# EAGLE design J3_output_haltTrace (EAGLE 7.5.0)
Redwave S310-J6 Output to 10 Pin MiniFit Valve Driver Board
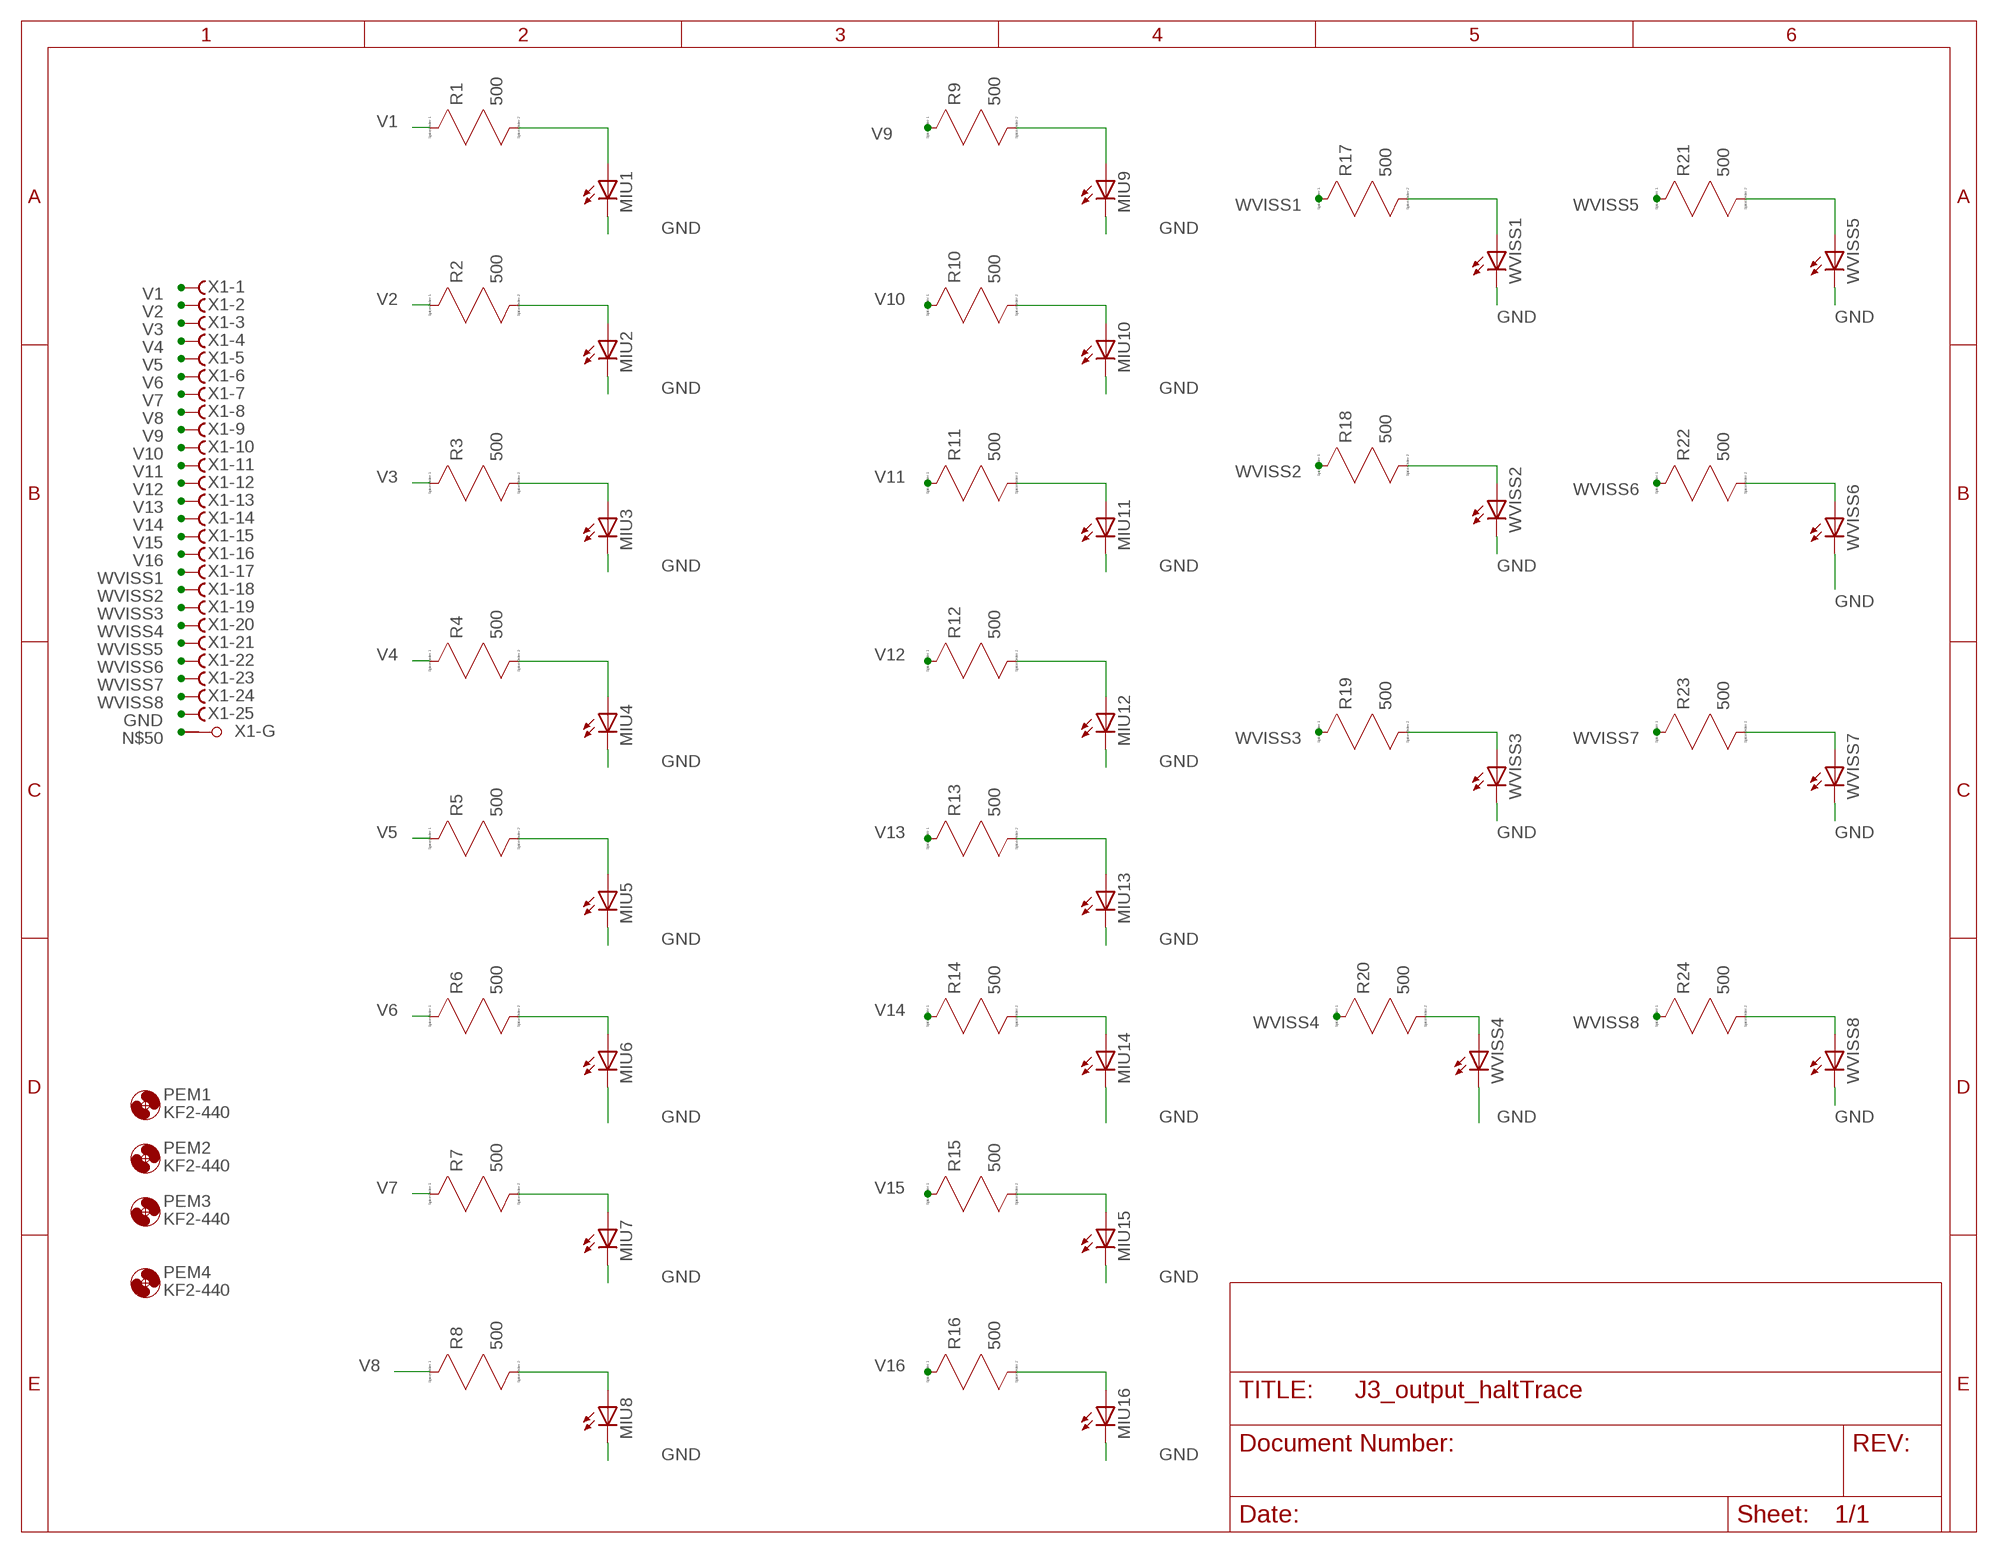
[diagram p0: schematic, sheet 1]

## Parts
MIU1  LED5MM  [LED5MM]
MIU2  LED5MM  [LED5MM]
MIU3  LED5MM  [LED5MM]
MIU4  LED5MM  [LED5MM]
MIU5  LED5MM  [LED5MM]
MIU6  LED5MM  [LED5MM]
MIU7  LED5MM  [LED5MM]
MIU8  LED5MM  [LED5MM]
MIU9  LED5MM  [LED5MM]
MIU10  LED5MM  [LED5MM]
MIU11  LED5MM  [LED5MM]
MIU12  LED5MM  [LED5MM]
MIU13  LED5MM  [LED5MM]
MIU14  LED5MM  [LED5MM]
MIU15  LED5MM  [LED5MM]
MIU16  LED5MM  [LED5MM]
PEM1  KF2-440  [KF2-440]
PEM2  KF2-440  [KF2-440]
PEM3  KF2-440  [KF2-440]
PEM4  KF2-440  [KF2-440]
R1  500  RES  [R0805]
R2  500  RES  [R0805]
R3  500  RES  [R0805]
R4  500  RES  [R0805]
R5  500  RES  [R0805]
R6  500  RES  [R0805]
R7  500  RES  [R0805]
R8  500  RES  [R0805]
R9  500  RES  [R0805]
R10  500  RES  [R0805]
R11  500  RES  [R0805]
R12  500  RES  [R0805]
R13  500  RES  [R0805]
R14  500  RES  [R0805]
R15  500  RES  [R0805]
R16  500  RES  [R0805]
R17  500  RES  [R0805]
R18  500  RES  [R0805]
R19  500  RES  [R0805]
R20  500  RES  [R0805]
R21  500  RES  [R0805]
R22  500  RES  [R0805]
R23  500  RES  [R0805]
R24  500  RES  [R0805]
WVISS1  LED5MM  [LED5MM]
WVISS2  LED5MM  [LED5MM]
WVISS3  LED5MM  [LED5MM]
WVISS4  LED5MM  [LED5MM]
WVISS5  LED5MM  [LED5MM]
WVISS6  LED5MM  [LED5MM]
WVISS7  LED5MM  [LED5MM]
WVISS8  LED5MM  [LED5MM]
X1  F25HPS  [F25HP]

## Nets
GND: MIU1.K(C) MIU2.K(C) MIU3.K(C) MIU4.K(C) MIU5.K(C) MIU6.K(C) MIU7.K(C) MIU8.K(C) MIU9.K(C) MIU10.K(C) MIU11.K(C) MIU12.K(C) MIU13.K(C) MIU14.K(C) MIU15.K(C) MIU16.K(C) WVISS1.K(C) WVISS2.K(C) WVISS3.K(C) WVISS4.K(C) WVISS5.K(C) WVISS6.K(C) WVISS7.K(C) WVISS8.K(C) X1.25(-25:F)
N$1: MIU1.A R1.2(B)
N$2: MIU2.A R2.2(B)
N$3: MIU3.A R3.2(B)
N$4: MIU4.A R4.2(B)
N$5: MIU5.A R5.2(B)
N$6: MIU6.A R6.2(B)
N$7: MIU7.A R7.2(B)
N$8: MIU8.A R8.2(B)
N$9: MIU9.A R9.2(B)
N$10: MIU10.A R10.2(B)
N$11: MIU11.A R11.2(B)
N$12: MIU12.A R12.2(B)
N$13: MIU13.A R13.2(B)
N$14: MIU14.A R14.2(B)
N$15: MIU15.A R15.2(B)
N$16: MIU16.A R16.2(B)
N$17: R17.2(B) WVISS1.A
N$18: R18.2(B) WVISS2.A
N$19: R19.2(B) WVISS3.A
N$20: R20.2(B) WVISS4.A
N$21: R21.2(B) WVISS5.A
N$22: R22.2(B) WVISS6.A
N$23: R23.2(B) WVISS7.A
N$24: R24.2(B) WVISS8.A
N$50: X1.G1(-G:G1)
V1: R1.1(A) X1.1(-1:F)
V2: R2.1(A) X1.2(-2:F)
V3: R3.1(A) X1.3(-3:F)
V4: R4.1(A) X1.4(-4:F)
V5: R5.1(A) X1.5(-5:F)
V6: R6.1(A) X1.6(-6:F)
V7: R7.1(A) X1.7(-7:F)
V8: R8.1(A) X1.8(-8:F)
V9: R9.1(A) X1.9(-9:F)
V10: R10.1(A) X1.10(-10:F)
V11: R11.1(A) X1.11(-11:F)
V12: R12.1(A) X1.12(-12:F)
V13: R13.1(A) X1.13(-13:F)
V14: R14.1(A) X1.14(-14:F)
V15: R15.1(A) X1.15(-15:F)
V16: R16.1(A) X1.16(-16:F)
WVISS1: R17.1(A) X1.17(-17:F)
WVISS2: R18.1(A) X1.18(-18:F)
WVISS3: R19.1(A) X1.19(-19:F)
WVISS4: R20.1(A) X1.20(-20:F)
WVISS5: R21.1(A) X1.21(-21:F)
WVISS6: R22.1(A) X1.22(-22:F)
WVISS7: R23.1(A) X1.23(-23:F)
WVISS8: R24.1(A) X1.24(-24:F)
Unconnected: X1.G2(-G:G2)

## Library data of the parts
MIU1-MIU16 WVISS1-WVISS8 = led:LED: LED OSRAM: - CHIPLED LG R971, LG N971, LY N971, LG Q971, LY Q971, LO R971, LY R971 LH N974, LH R974 LS Q976, LO Q976, LY Q976 LO Q996 - Hyper CHIPLED LW Q18S LB Q993, LB Q99A, LB R99A - SideLED LS A670, LO A670, LY A670, LG A670, LP A670 LB A673, LV A673, LT A673, LW A673 LH A674 LY A675 LS A676, LA A676, LO A676, LY A676, LW A676 LS A679, LY A679, LG A679 - Hyper Micro SIDELED® LS Y876, LA Y876, LO Y876, LY Y876 LT Y87S - SmartLED LW L88C, LW L88S LB L89C, LB L89S, LG L890 LS L89K, LO L89K, LY L89K LS L896, LA L896, LO L896, LY L896 - TOPLED LS T670, LO T670, LY T670, LG T670, LP T670 LSG T670, LSP T670, LSY T670, LOP T670, LYG T670 LG T671, LOG T671, LSG T671 LB T673, LV T673, LT T673, LW T673 LH T674 LS T676, LA T676, LO T676, LY T676, LB T676, LH T676, LSB T676, LW T676 LB T67C, LV T67C, LT T67C, LS T67K, LO T67K, LY T67K, LW E67C LS E67B, LA E67B, LO E67B, LY E67B, LB E67C, LV E67C, LT E67C LW T67C LS T679, LY T679, LG T679 LS T770, LO T770, LY T770, LG T770, LP T770 LB T773, LV T773, LT T773, LW T773 LH T774 LS E675, LA E675, LY E675, LS T675 LS T776, LA T776, LO T776, LY T776, LB T776 LHGB T686 LT T68C, LB T68C - Hyper Mini TOPLED® LB M676 - Mini TOPLED Santana® LG M470 LS M47K, LO M47K, LY M47K Source: http://www.osram.convergy.de LUXEON: - LUMILED® LXK2-PW12-R00, LXK2-PW12-S00, LXK2-PW14-U00, LXK2-PW14-V00 LXK2-PM12-R00, LXK2-PM12-S00, LXK2-PM14-U00 LXK2-PE12-Q00, LXK2-PE12-R00, LXK2-PE12-S00, LXK2-PE14-T00, LXK2-PE14-U00 LXK2-PB12-K00, LXK2-PB12-L00, LXK2-PB12-M00, LXK2-PB14-N00, LXK2-PB14-P00, LXK2-PB14-Q00 LXK2-PR12-L00, LXK2-PR12-M00, LXK2-PR14-Q00, LXK2-PR14-R00 LXK2-PD12-Q00, LXK2-PD12-R00, LXK2-PD12-S00 LXK2-PH12-R00, LXK2-PH12-S00 LXK2-PL12-P00, LXK2-PL12-Q00, LXK2-PL12-R00 Source: www.luxeon.com KINGBRIGHT: KA-3528ASYC Source: www.kingbright.com; OC_NEWARK: unknown
PEM1-PEM4 = penn-engineering:KF2-: TYPE KF2 AND KFS2 BROACHING NUTS
R1-R24 = sym:RES: A resistor; MF: BC COMPONENTS; MPN: SFR2500001401FR500; OC_NEWARK: 94C4790
X1 = con-subd:F25HPS: SUB-D; OC_FARNELL: unknown; OC_NEWARK: unknown

## Board
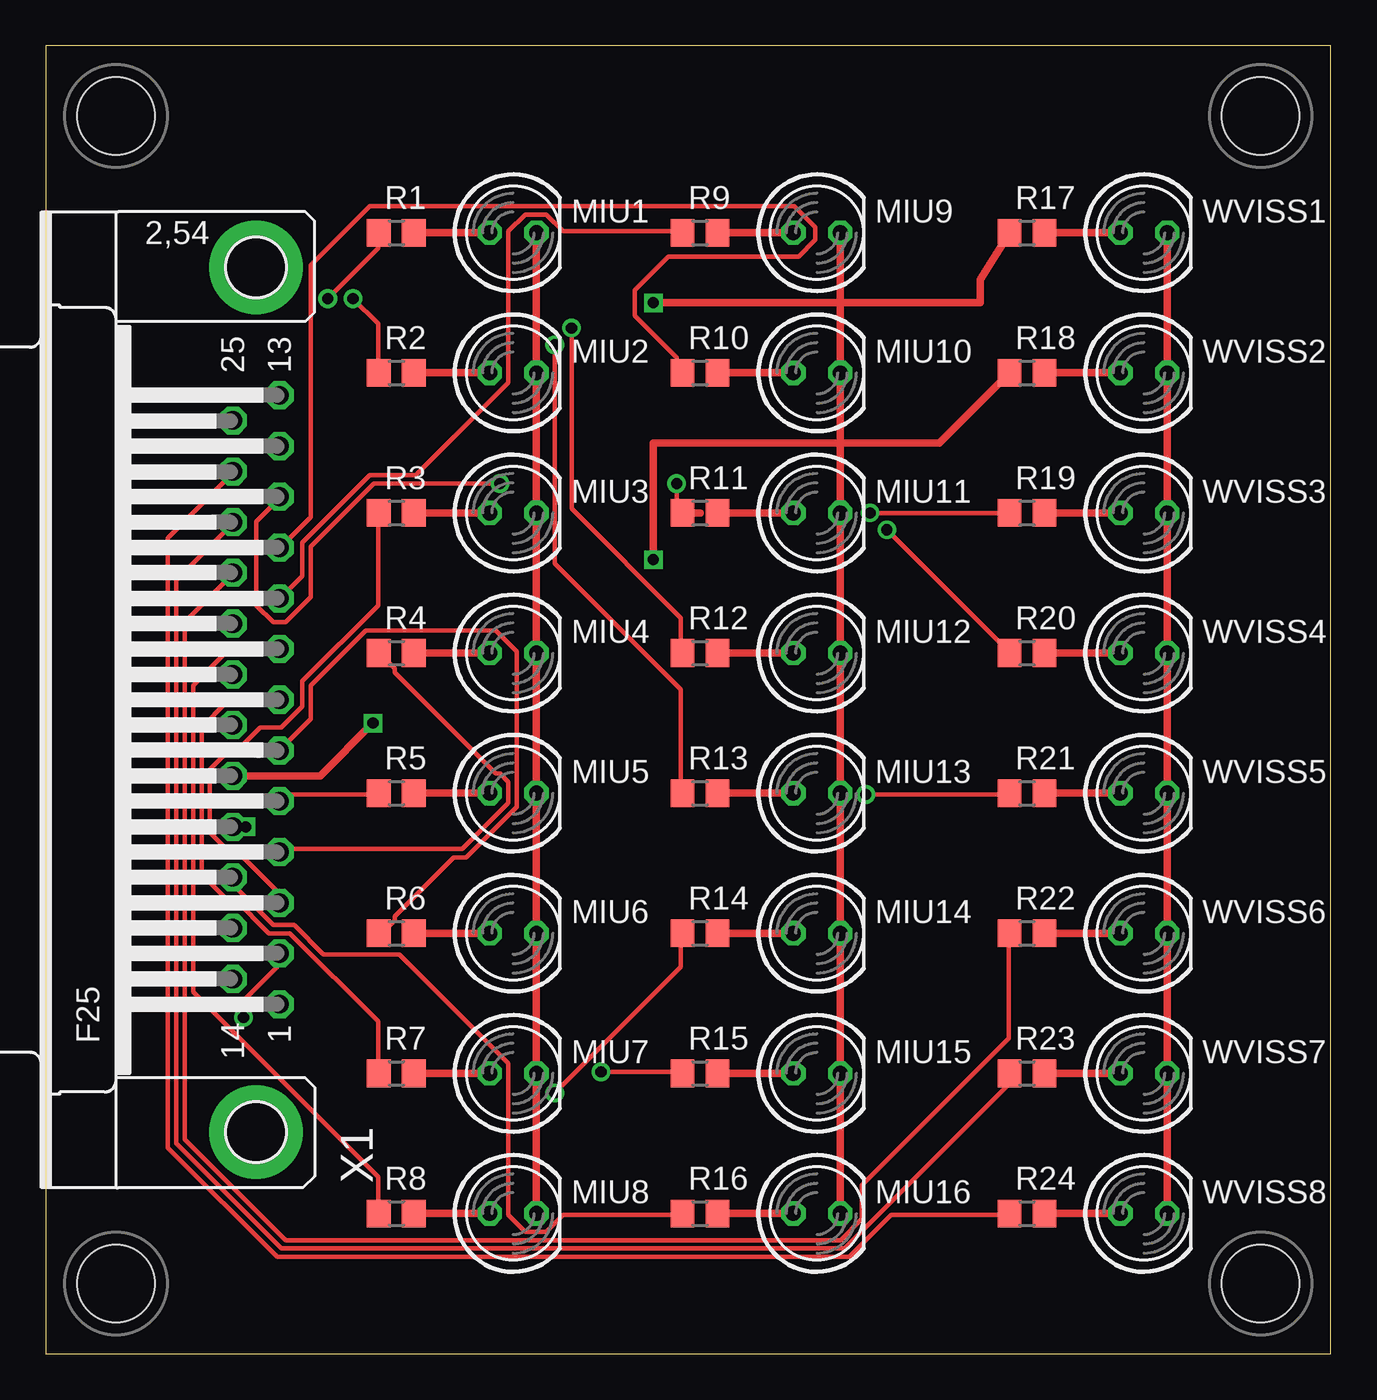
[diagram p1: board, top side]
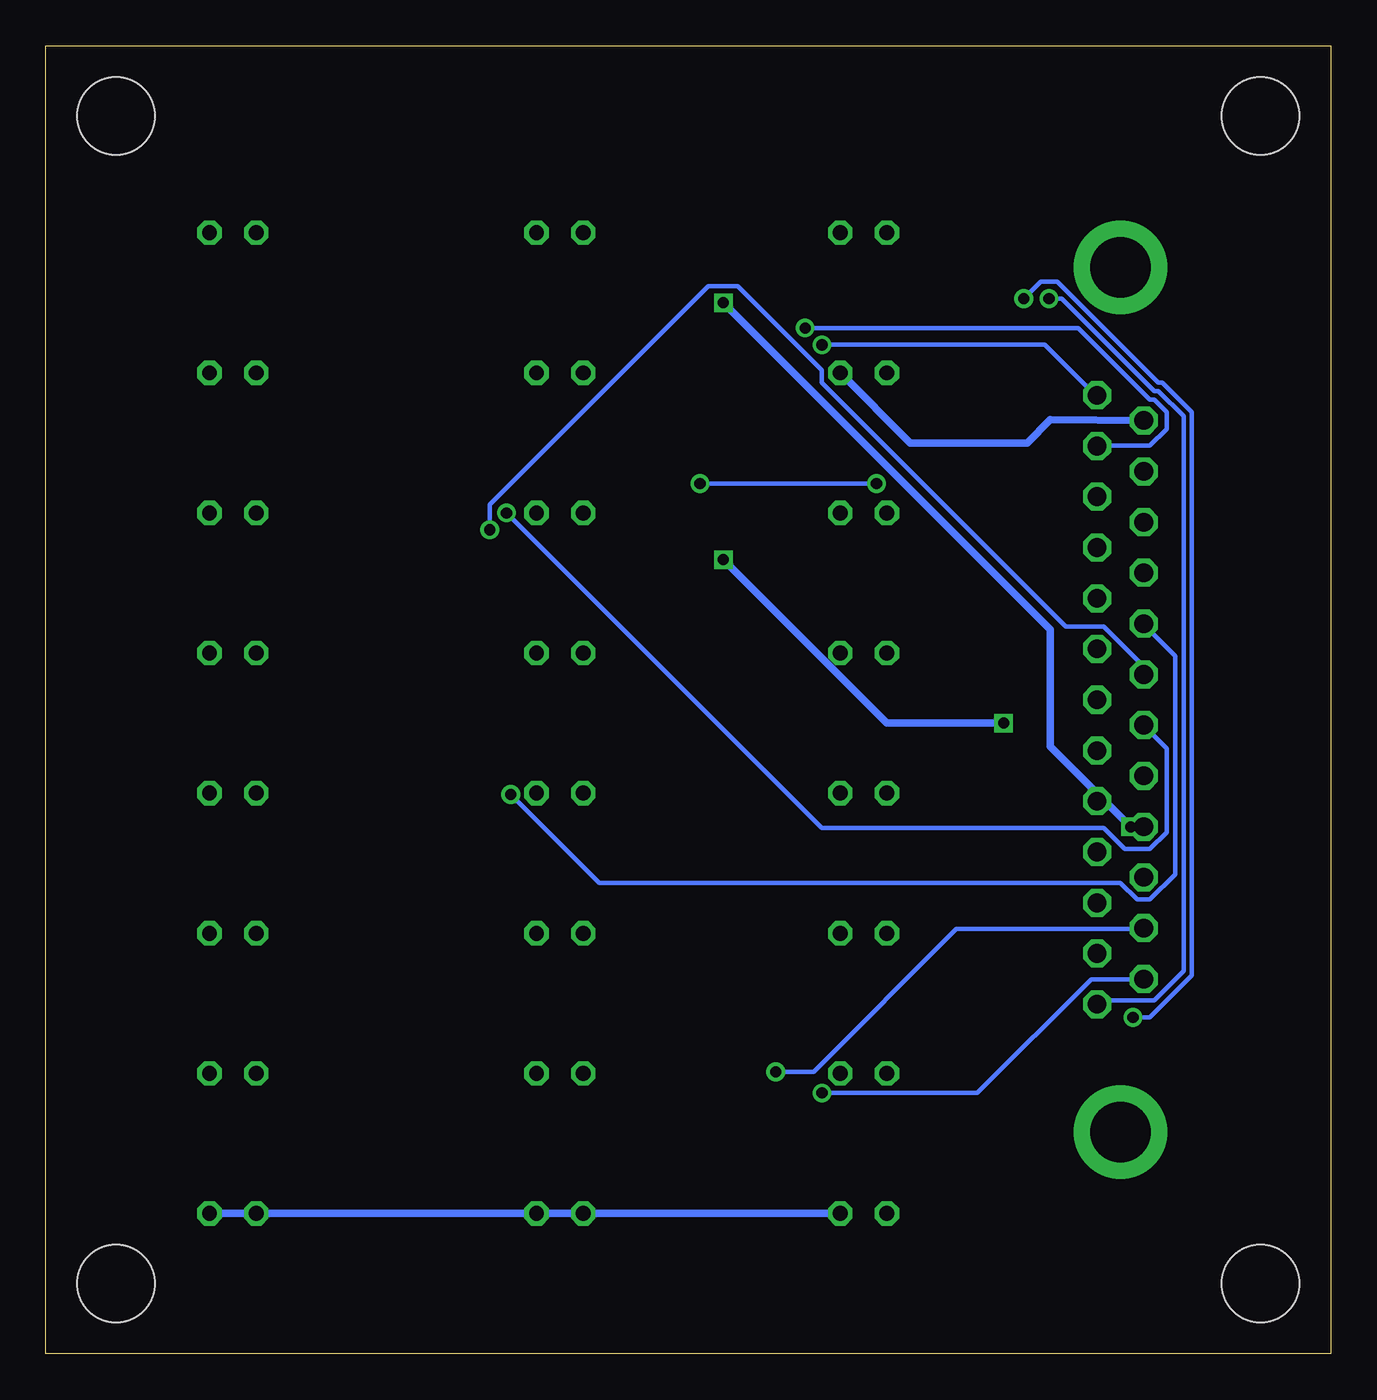
[diagram p2: board, bottom side, seen from below]

Size 69.85 x 71.12 mm. Coordinates in mm from the lower left corner, seen from the top.
Outline: 0,0 69.85,0 69.85,71.12 0,71.12 0,0
Copper layers (1*16): Top 0.035mm / dielectric 1.5mm / Bottom 0.035mm
Design rules "default": minimum track width 10mil, minimum drill 24mil, track to track 8mil, track to pad 8mil, pad to pad 8mil, via to via 8mil, smd to smd 8mil, copper to edge 40mil, drill to drill 8mil, minimum pad ring 10mil, minimum via ring 8mil, stop-mask expansion 4mil, vias tented up to drill 0mil, thermal gap 10mil

### Footprints (pad centres in the part's own frame; a part is rotated, then mirrored left to right if it is on the bottom)
LED5MM = drill 0.813 octagon: A -1.27,0; K 1.27,0
KF2-440 = hole 4.216: 0,0
R0805 = smd 1.3 x 1.5: 1 -0.95,0; 2 0.95,0
F25HP = drill 1.016 octagon: 1 -16.561,-1.27; 2 -13.792,-1.27; 3 -11.049,-1.27; 4 -8.28,-1.27; 5 -5.512,-1.27; 6 -2.769,-1.27; 7 0,-1.27; 8 2.769,-1.27; 9 5.512,-1.27; 10 8.28,-1.27; 11 11.049,-1.27; 12 13.792,-1.27; 13 16.561,-1.27; 14 -15.189,1.27; 15 -12.421,1.27; 16 -9.652,1.27; 17 -6.909,1.27; 18 -4.14,1.27; 19 -1.372,1.27; 20 1.372,1.27; 21 4.14,1.27; 22 6.909,1.27; 23 9.652,1.27; 24 12.421,1.27; 25 15.189,1.27 | drill 3.302 pad 5.08: G1 -23.52,0; G2 23.52,0

### Placement (x,y rotation side)
MIU1  25.4,60.96 0 top
MIU2  25.4,53.34 0 top
MIU3  25.4,45.72 0 top
MIU4  25.4,38.1 0 top
MIU5  25.4,30.48 0 top
MIU6  25.4,22.86 0 top
MIU7  25.4,15.24 0 top
MIU8  25.4,7.62 0 top
MIU9  41.91,60.96 0 top
MIU10  41.91,53.34 0 top
MIU11  41.91,45.72 0 top
MIU12  41.91,38.1 0 top
MIU13  41.91,30.48 0 top
MIU14  41.91,22.86 0 top
MIU15  41.91,15.24 0 top
MIU16  41.91,7.62 0 top
PEM1  3.81,3.81 0 top
PEM2  3.81,67.31 0 top
PEM3  66.04,3.81 0 top
PEM4  66.04,67.31 0 top
R1  19.05,60.96 0 top
R2  19.05,53.34 0 top
R3  19.05,45.72 0 top
R4  19.05,38.1 0 top
R5  19.05,30.48 0 top
R6  19.05,22.86 0 top
R7  19.05,15.24 0 top
R8  19.05,7.62 0 top
R9  35.56,60.96 0 top
R10  35.56,53.34 0 top
R11  35.56,45.72 0 top
R12  35.56,38.1 0 top
R13  35.56,30.48 0 top
R14  35.56,22.86 0 top
R15  35.56,15.24 0 top
R16  35.56,7.62 0 top
R17  53.34,60.96 0 top
R18  53.34,53.34 0 top
R19  53.34,45.72 0 top
R20  53.34,38.1 0 top
R21  53.34,30.48 0 top
R22  53.34,22.86 0 top
R23  53.34,15.24 0 top
R24  53.34,7.62 0 top
WVISS1  59.69,60.96 0 top
WVISS2  59.69,53.34 0 top
WVISS3  59.69,45.72 0 top
WVISS4  59.69,38.1 0 top
WVISS5  59.69,30.48 0 top
WVISS6  59.69,22.86 0 top
WVISS7  59.69,15.24 0 top
WVISS8  59.69,7.62 0 top
X1  11.43,35.56 90 top

### Tracks (layer width: path | path; a pad name or v marks a point on that pad's centre or on a via)
GND
  Top 0.406: MIU1.K MIU2.K MIU3.K MIU4.K MIU5.K MIU6.K MIU7.K MIU8.K | MIU9.K MIU10.K MIU11.K MIU12.K MIU13.K MIU14.K MIU15.K MIU16.K | WVISS1.K WVISS2.K WVISS3.K WVISS4.K WVISS5.K WVISS6.K WVISS7.K WVISS8.K
  Bottom 0.406: X1.25 15.24,50.8 16.51,49.53 22.86,49.53 MIU2.K | MIU8.K MIU16.K WVISS8.K
N$1
  Top 0.406: R1.2 MIU1.A
N$2
  Top 0.406: R2.2 MIU2.A
N$3
  Top 0.406: R3.2 MIU3.A
N$4
  Top 0.406: MIU4.A R4.2
N$5
  Top 0.406: R5.2 MIU5.A
N$6
  Top 0.406: R6.2 MIU6.A
N$7
  Top 0.406: R7.2 MIU7.A
N$8
  Top 0.406: R8.2 MIU8.A
N$9
  Top 0.406: R9.2 MIU9.A
N$10
  Top 0.406: R10.2 MIU10.A
N$11
  Top 0.406: R11.2 MIU11.A
N$12
  Top 0.406: R12.2 MIU12.A
N$13
  Top 0.406: R13.2 MIU13.A
N$14
  Top 0.406: R14.2 MIU14.A
N$15
  Top 0.406: R15.2 MIU15.A
N$16
  Top 0.406: R16.2 MIU16.A
N$17
  Top 0.406: R17.2 WVISS1.A
N$18
  Top 0.406: R18.2 WVISS2.A
N$19
  Top 0.406: R19.2 WVISS3.A
N$20
  Top 0.406: R20.2 WVISS4.A
N$21
  Top 0.406: R21.2 WVISS5.A
N$22
  Top 0.406: R22.2 WVISS6.A
N$23
  Top 0.406: R23.2 WVISS7.A
N$24
  Top 0.406: R24.2 WVISS8.A
V1  (via drill 0.61)
  Top 0.254: v15.32,57.38 18.06,60.12 18.06,60.81 R1.1
  Bottom 0.254: v15.32,57.38 14.63,57.38 9.6,52.35 9.37,52.35 8,50.98 8,20.8 9.6,19.2 12.57,19.2 X1.1
V2  (via drill 0.61)
  Top 0.254: v16.69,57.38 18.06,56.01 18.06,53.49 R2.1 | v10.74,18.29 10.74,19.2 12.57,21.03 12.57,21.72 X1.2
  Bottom 0.254: v16.69,57.38 15.77,58.29 14.86,58.29 9.37,52.81 9.14,52.81 7.54,51.21 7.54,20.57 9.83,18.29 v10.74,18.29
V3
  Top 0.254: R3.1 18.06,45.72 18.06,40.69 13.95,36.58 13.95,35.2 12.8,34.06 11.66,34.06 10.29,32.69 9.83,32.69 8.91,31.77 8.91,28.35 10.06,27.2 10.52,27.2 12.57,25.15 12.57,24.69 X1.3
V4
  Top 0.254: R4.1 18.29,37.95 18.97,37.26 18.97,37.03 24.46,31.55 24.69,31.55 25.15,31.09 25.15,29.95 22.63,27.43 12.8,27.43 X1.4
V5
  Top 0.254: R5.1 18.06,30.4 13.03,30.4 12.8,30.18 X1.5
V6
  Top 0.254: R6.1 18.29,22.86 18.97,23.55 18.97,23.77 22.17,26.98 22.86,26.98 25.6,29.72 25.6,38.18 24.46,39.32 17.37,39.32 14.4,36.35 14.4,34.52 12.8,32.92 X1.6
V7
  Top 0.254: R7.1 18.06,15.32 18.06,18.06 13.26,22.86 12.12,22.86 10.29,24.69 9.83,24.69 8.46,26.06 8.46,34.06 9.83,35.43 12.57,35.43 X1.7
V8
  Top 0.254: R8.1 18.06,7.77 18.06,9.6 8,19.66 8,36.35 9.83,38.18 12.57,38.18 X1.8
V9
  Top 0.254: R9.1 34.29,61.04 28.12,61.04 27.2,61.95 26.06,61.95 25.15,61.04 25.15,52.81 20.12,47.78 17.6,47.78 13.95,44.12 13.95,42.29 12.8,41.15 X1.9
  Top 0.406: R9.1 34.29,60.96
V10
  Top 0.254: R10.1 34.29,53.49 34.29,54.18 32,56.46 32,57.84 33.83,59.66 40.92,59.66 41.83,60.58 41.83,61.27 40.69,62.41 17.6,62.41 14.4,59.21 14.4,45.49 12.8,43.89 X1.10
  Top 0.406: R10.1 34.29,53.34
V11  (via drill 0.61)
  Top 0.254: v34.29,47.32 34.29,45.72 | v24.69,47.32 17.83,47.32 14.4,43.89 14.4,41.15 13.03,39.78 12.34,39.78 11.43,40.69 11.43,45.26 12.57,46.41 X1.11
  Top 0.406: 35.56,45.72 R11.1 34.29,45.72
  Bottom 0.254: v24.69,47.32 v34.29,47.32
V12  (via drill 0.61)
  Top 0.254: v28.57,55.78 28.57,45.95 34.52,40.01 34.52,38.18 R12.1
  Bottom 0.254: v28.57,55.78 13.72,55.78 9.83,51.89 9.6,51.89 8.91,51.21 8.91,50.29 9.83,49.38 12.57,49.38 X1.12
V13  (via drill 0.61)
  Top 0.254: v27.66,54.86 27.66,42.98 34.52,36.12 34.52,30.63 R13.1
  Bottom 0.254: v27.66,54.86 15.54,54.86 12.8,52.12 X1.13
V14  (via drill 0.61)
  Top 0.254: v27.66,14.17 34.52,21.03 34.52,22.86 R14.1
  Bottom 0.254: v27.66,14.17 19.2,14.17 13.03,20.34 10.29,20.34 X1.14
V15  (via drill 0.61)
  Top 0.254: v30.18,15.32 34.52,15.32 R15.1
  Bottom 0.254: v30.18,15.32 28.12,15.32 20.34,23.09 10.29,23.09 X1.15
V16
  Top 0.254: R16.1 34.52,7.54 28.12,7.54 27.2,6.63 26.06,6.63 25.15,7.54 25.15,15.77 19.2,21.72 15.09,21.72 13.49,23.32 12.34,23.32 10.29,25.38 10.29,25.83 X1.16
WVISS1  (via drill 0.6)
  Top 0.406: R17.1 50.8,58.42 50.8,57.15 v33.02,57.15 | v10.87,28.65 X1.17
  Bottom 0.406: v33.02,57.15 15.24,39.37 15.24,33.02 v10.87,28.65
WVISS2  (via drill 0.6)
  Top 0.406: R18.1 48.58,49.53 33.02,49.53 v33.02,43.18 | v17.78,34.29 14.91,31.42 X1.18
  Bottom 0.406: v33.02,43.18 24.13,34.29 v17.78,34.29
WVISS3  (via drill 0.61)
  Top 0.254: v44.81,45.72 R19.1
  Bottom 0.254: v44.81,45.72 27.66,28.57 12.34,28.57 11.2,27.43 9.83,27.43 8.91,28.35 8.91,32.92 10.06,34.06 X1.19
WVISS4  (via drill 0.61)
  Top 0.254: v45.72,44.81 52.35,38.18 R20.1
  Bottom 0.254: v45.72,44.81 45.72,46.18 33.83,58.06 32.23,58.06 27.66,53.49 27.66,52.81 14.4,39.55 12.34,39.55 10.29,37.49 10.29,37.03 X1.20
WVISS5  (via drill 0.61)
  Top 0.254: v44.58,30.4 52.35,30.4 R21.1
  Bottom 0.254: v44.58,30.4 39.78,25.6 11.43,25.6 10.52,24.69 9.83,24.69 8.46,26.06 8.46,37.95 10.06,39.55 X1.21
WVISS6
  Top 0.254: R22.1 52.35,22.86 52.35,17.14 44.35,9.14 44.35,7.32 43.2,6.17 13.03,6.17 7.54,11.66 7.54,39.78 10.06,42.29 X1.22
WVISS7
  Top 0.254: R23.1 52.35,15.09 52.35,14.63 43.43,5.71 12.8,5.71 7.09,11.43 7.09,42.06 10.06,45.03 X1.23
WVISS8
  Top 0.254: R24.1 51.89,7.54 45.95,7.54 43.66,5.26 12.57,5.26 6.63,11.2 6.63,44.35 10.06,47.78 X1.24
  Top 0.406: R24.1 52.07,7.62